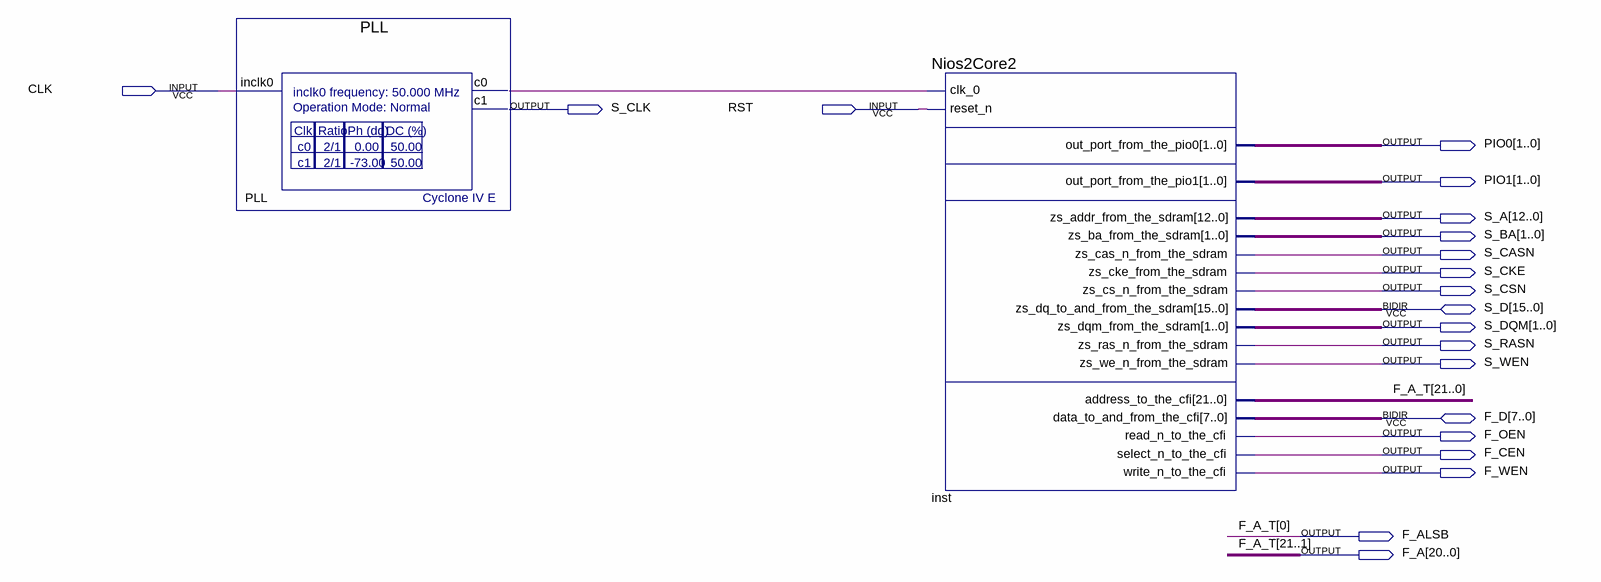
[diagram p0: schematic sheet]
// Quartus schematic multiCore.bdf as structural Verilog: 2 symbols, 20 pins
module multiCore (
  input  CLK,
  input  RST,
  inout  [15:0] S_D,
  inout  [7:0] F_D,
  output S_CLK,
  output [1:0] PIO0,
  output [1:0] PIO1,
  output [12:0] S_A,
  output [1:0] S_BA,
  output S_CASN,
  output S_CKE,
  output S_CSN,
  output [1:0] S_DQM,
  output S_RASN,
  output S_WEN,
  output F_OEN,
  output F_CEN,
  output F_WEN,
  output F_ALSB,
  output [20:0] F_A
);

  wire PLL_c0;

  PLL PLL (.inclk0(CLK), .c0(PLL_c0), .c1(S_CLK));
  Nios2Core2 inst (
    .clk_0(PLL_c0), .reset_n(RST), .out_port_from_the_pio0(PIO0), .out_port_from_the_pio1(PIO1),
    .zs_addr_from_the_sdram(S_A), .zs_ba_from_the_sdram(S_BA), .zs_cas_n_from_the_sdram(S_CASN),
    .zs_cke_from_the_sdram(S_CKE), .zs_cs_n_from_the_sdram(S_CSN), .zs_dqm_from_the_sdram(S_DQM),
    .zs_ras_n_from_the_sdram(S_RASN), .zs_we_n_from_the_sdram(S_WEN), .address_to_the_cfi({F_A, F_ALSB}),
    .read_n_to_the_cfi(F_OEN), .select_n_to_the_cfi(F_CEN), .write_n_to_the_cfi(F_WEN),
    .zs_dq_to_and_from_the_sdram(S_D), .data_to_and_from_the_cfi(F_D));

  // Other names for the same wires on the sheet: F_A_T[21:0] = {F_A, F_ALSB}
endmodule
